# Altium project PCB_15122020_01BC.PrjPcb (part 5 of 9)

## Sheet RaspberyConnector.SchDoc
size A3
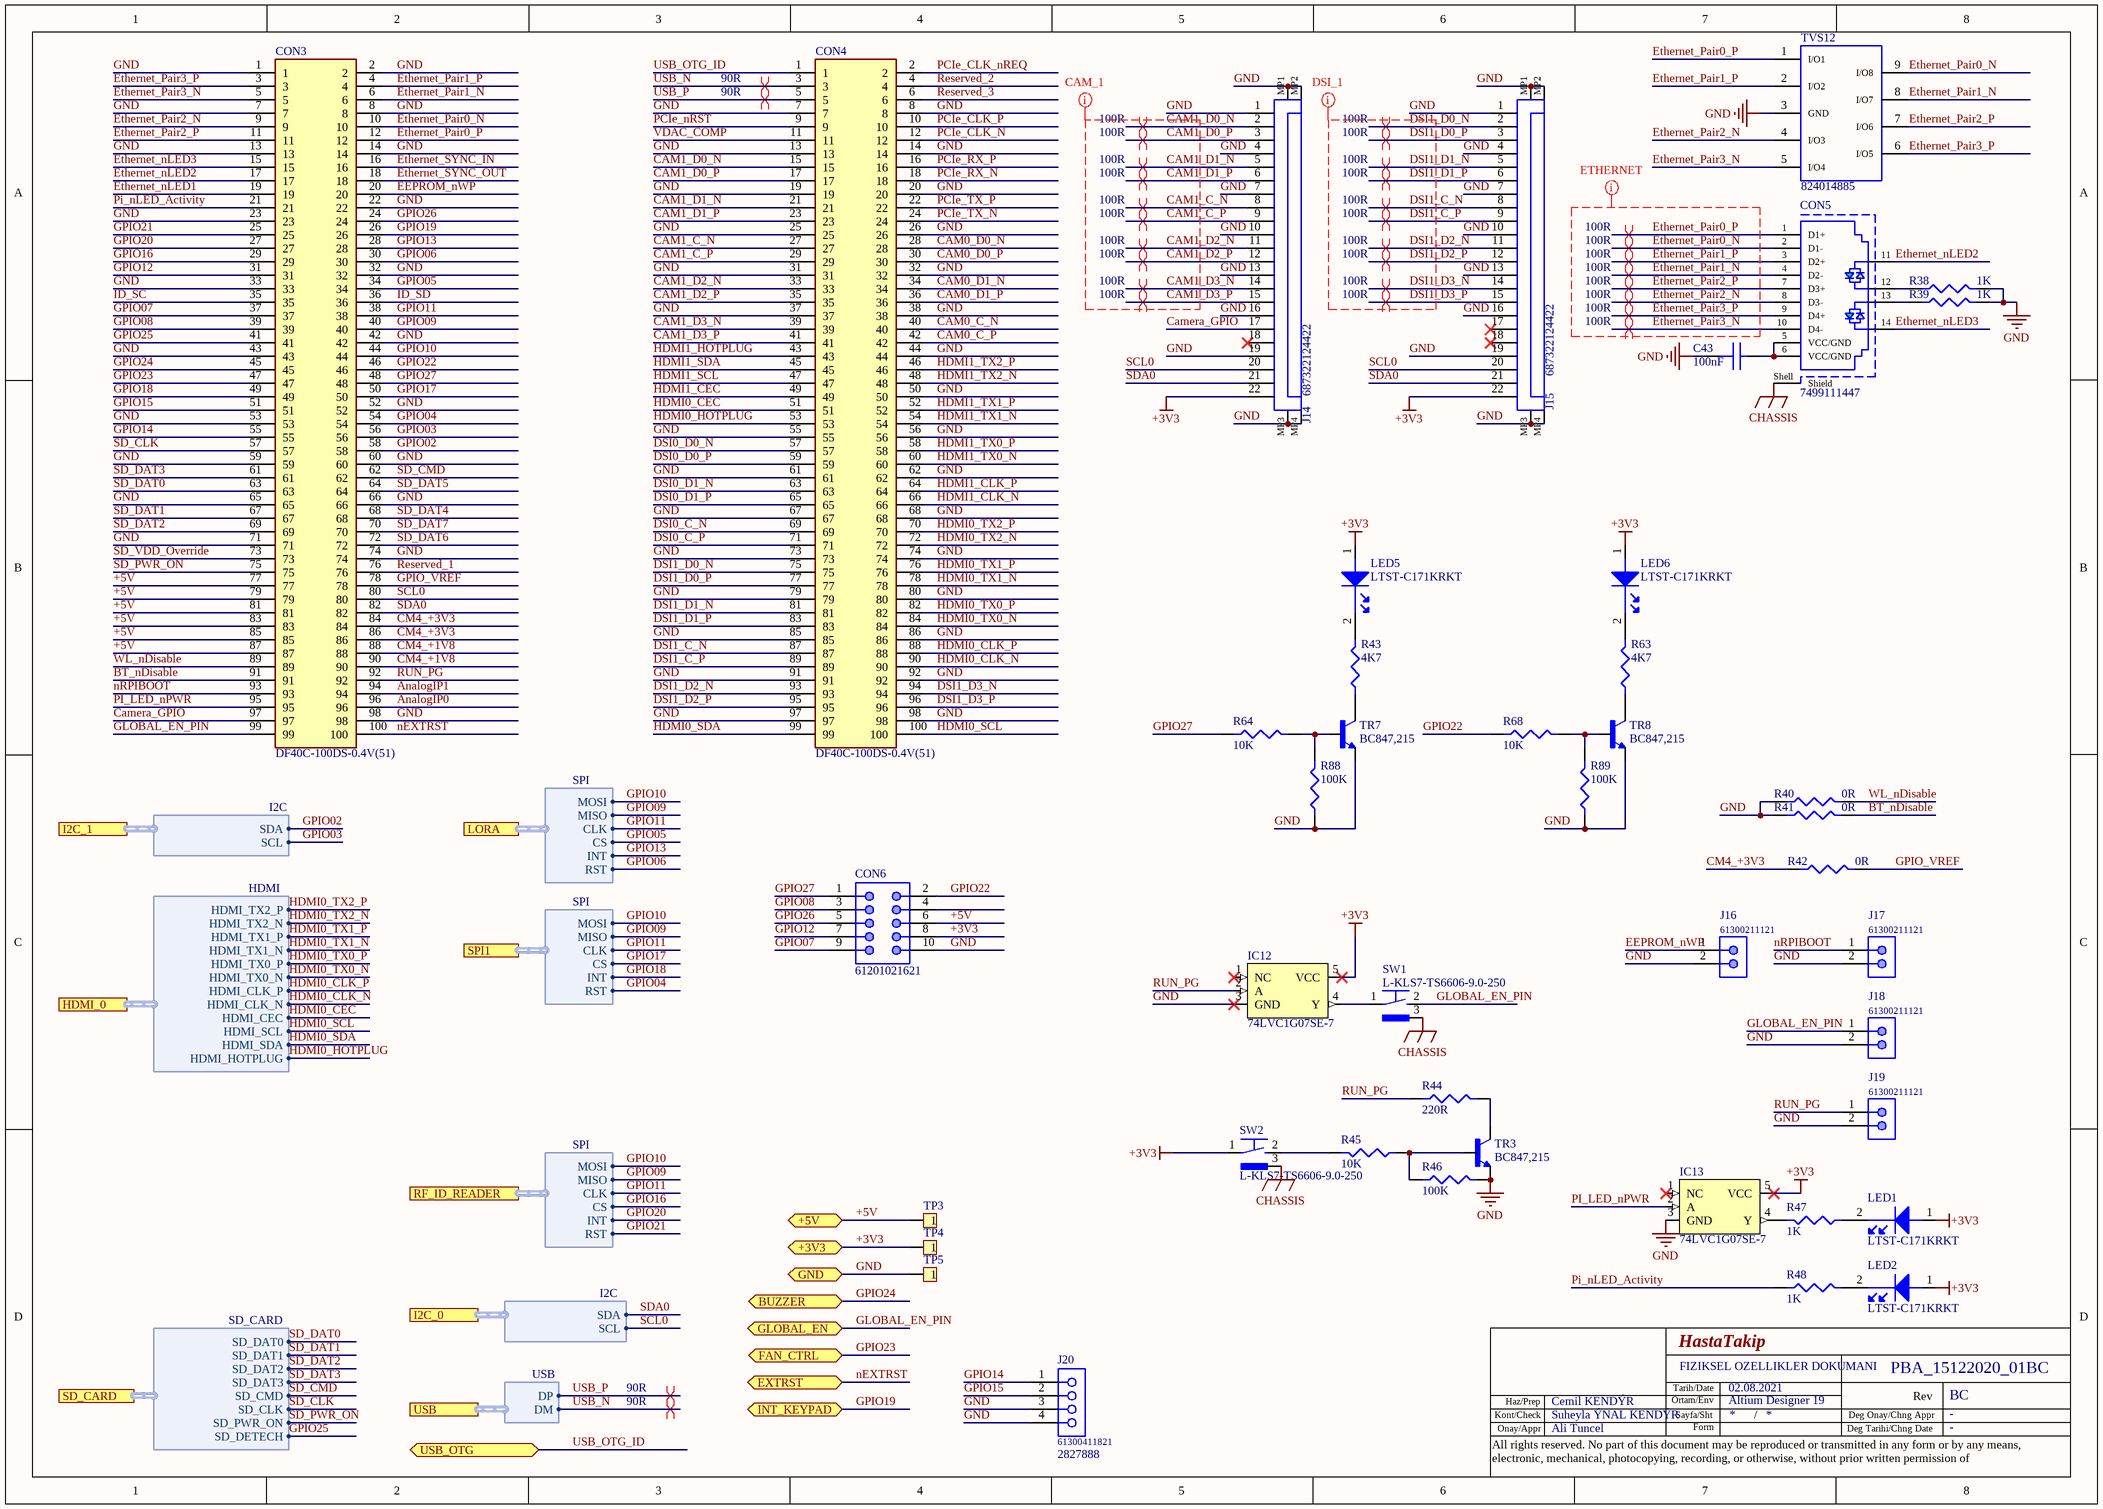
[diagram p4: RaspberyConnector.SchDoc]

### Parts
C43  100nF  [C0603]
CON3  DF40C-100DS-0.4V(51)  [HRS_DF40C-100DS-0.4V(51)]
CON4  DF40C-100DS-0.4V(51)  [HRS_DF40C-100DS-0.4V(51)]
CON5  7499111447  [7499111447]
CON6  61201021621  [61201021621]
IC12  74LVC1G07SE-7  [SOT353]
IC13  74LVC1G07SE-7  [SOT353]
J14  687322124422  [687322124422]
J15  687322124422  [687322124422]
J16  61300211121  [61300211121]
J17  61300211121  [61300211121]
J18  61300211121  [61300211121]
J19  61300211121  [61300211121]
J20  61300411821  Supplier Part Number 1: 2827888  [61300411821]
LED1  LTST-C171KRKT  [0805_RED]
LED2  LTST-C171KRKT  [0805_RED]
LED5  LTST-C171KRKT  [0805_RED]
LED6  LTST-C171KRKT  [0805_RED]
R38  1K  [R0603]
R39  1K  [R0603]
R40  0R  [R0603]
R41  0R  [R0603]
R42  0R  [R0603]
R43  4K7  [R0603]
R44  220R  [R0603]
R45  10K  [R0603]
R46  100K  [R0603]
R47  1K  [R0603]
R48  1K  [R0603]
R63  4K7  [R0603]
R64  10K  [R0603]
R68  10K  [R0603]
R88  100K  [R0603]
R89  100K  [R0603]
SW1  L-KLS7-TS6606-9.0-250  [Right angle 9mm]
SW2  L-KLS7-TS6606-9.0-250  [Right angle 9mm]
TP3  TestPoint1  [SMD_2mmPoint]  (value not drawn)
TP4  TestPoint1  [SMD_2mmPoint]  (value not drawn)
TP5  TestPoint1  [SMD_2mmPoint]  (value not drawn)
TR3  BC847,215  [SOT23]
TR7  BC847,215  [SOT23]
TR8  BC847,215  [SOT23]
TVS12  824014885  [WE-TVS_DFN3810-9L]

### Ports
+3V3 (bidir), +5V (bidir), BUZZER (bidir), EXTRST (bidir), FAN_CTRL (bidir), GLOBAL_EN (bidir), GND (bidir), HDMI_0 (harness HDMI), I2C_0 (harness I2C), I2C_1 (harness I2C), INT_KEYPAD (bidir), LORA (harness SPI), RF_ID_READER (harness SPI), SD_CARD (harness SD_CARD), SPI1 (harness SPI), USB (harness USB), USB_OTG (bidir)

### Harnesses
USB: DP, DM
I2C: SCL, SDA
HDMI: HDMI_CLK_N, HDMI_TX2_P, HDMI_CLK_P, HDMI_TX0_N, HDMI_TX2_N, HDMI_TX1_P, HDMI_TX1_N, HDMI_TX0_P, HDMI_CEC, HDMI_SCL, HDMI_SDA, HDMI_HOTPLUG
SD_CARD: SD_DAT0, SD_DAT1, SD_DAT2, SD_DAT3, SD_CMD, SD_CLK, SD_PWR_ON, SD_DETECH
SPI: MOSI, MISO, CLK, CS, INT, RST

### Nets
+3V3: CON6.8 IC12.5(VCC) IC13.5(VCC) J14.22 J15.22 LED1.1 LED2.1 LED5.1 LED6.1 SW2.1 TP4.1 ; port +3V3
+5V: CON3.77 CON3.79 CON3.81 CON3.83 CON3.85 CON3.87 CON6.6 TP3.1 ; port +5V
CHASSIS: CON5.Shell(Shield) SW1.3 SW2.3
GND: C43.2 CON3.1 CON3.2 CON3.7 CON3.8 CON3.13 CON3.14 CON3.22 CON3.23 CON3.32 CON3.33 CON3.42 CON3.43 CON3.52 CON3.53 CON3.59 CON3.60 CON3.65 CON3.66 CON3.71 CON3.74 CON3.98 CON4.7 CON4.8 CON4.13 CON4.14 CON4.19 CON4.20 CON4.25 CON4.26 CON4.31 CON4.32 CON4.37 CON4.38 CON4.44 CON4.50 CON4.55 CON4.56 CON4.61 CON4.62 CON4.67 CON4.68 CON4.73 CON4.74 CON4.79 CON4.80 CON4.85 CON4.86 CON4.91 CON4.92 CON4.97 CON4.98 CON6.10 IC12.3(GND) IC13.3(GND) J14.1 J14.4 J14.7 J14.10 J14.13 J14.16 J14.19 J14.MP1 J14.MP2 J14.MP3 J14.MP4 J15.1 J15.4 J15.7 J15.10 J15.13 J15.16 J15.19 J15.MP1 J15.MP2 J15.MP3 J15.MP4 J16.2 J17.2 J18.2 J19.2 J20.3 J20.4 R38.2 R39.2 R40.1 R41.1 R46.2 R88.1 R89.1 TP5.1 TR3.2(E) TR7.2(E) TR8.2(E) TVS12.3(GND) ; port GND
AnalogIP0: CON3.96
AnalogIP1: CON3.94
BT_nDisable: CON3.91 R41.2
CAM0_C_N: CON4.40
CAM0_C_P: CON4.42
CAM0_D0_N: CON4.28
CAM0_D0_P: CON4.30
CAM0_D1_N: CON4.34
CAM0_D1_P: CON4.36
CAM1_C_N: CON4.27 J14.8
CAM1_C_P: CON4.29 J14.9
CAM1_D0_N: CON4.15 J14.2
CAM1_D0_P: CON4.17 J14.3
CAM1_D1_N: CON4.21 J14.5
CAM1_D1_P: CON4.23 J14.6
CAM1_D2_N: CON4.33 J14.11
CAM1_D2_P: CON4.35 J14.12
CAM1_D3_N: CON4.39 J14.14
CAM1_D3_P: CON4.41 J14.15
Camera_GPIO: CON3.97 J14.17
CM4_+1V8: CON3.88 CON3.90
CM4_+3V3: CON3.84 CON3.86 R42.1
DSI0_C_N: CON4.69
DSI0_C_P: CON4.71
DSI0_D0_N: CON4.57
DSI0_D0_P: CON4.59
DSI0_D1_N: CON4.63
DSI0_D1_P: CON4.65
DSI1_C_N: CON4.87 J15.8
DSI1_C_P: CON4.89 J15.9
DSI1_D0_N: CON4.75 J15.2
DSI1_D0_P: CON4.77 J15.3
DSI1_D1_N: CON4.81 J15.5
DSI1_D1_P: CON4.83 J15.6
DSI1_D2_N: CON4.93 J15.11
DSI1_D2_P: CON4.95 J15.12
DSI1_D3_N: CON4.94 J15.14
DSI1_D3_P: CON4.96 J15.15
EEPROM_nWP: CON3.20 J16.1
Ethernet_nLED1: CON3.19
Ethernet_nLED2: CON3.17 CON5.11
Ethernet_nLED3: CON3.15 CON5.14
Ethernet_Pair0_N: CON3.10 CON5.2(D1-) TVS12.9(I/O8)
Ethernet_Pair0_P: CON3.12 CON5.1(D1+) TVS12.1(I/O1)
Ethernet_Pair1_N: CON3.6 CON5.4(D2-) TVS12.8(I/O7)
Ethernet_Pair1_P: CON3.4 CON5.3(D2+) TVS12.2(I/O2)
Ethernet_Pair2_N: CON3.9 CON5.8(D3-) TVS12.4(I/O3)
Ethernet_Pair2_P: CON3.11 CON5.7(D3+) TVS12.7(I/O6)
Ethernet_Pair3_N: CON3.5 CON5.10(D4-) TVS12.5(I/O4)
Ethernet_Pair3_P: CON3.3 CON5.9(D4+) TVS12.6(I/O5)
Ethernet_SYNC_IN: CON3.16
Ethernet_SYNC_OUT: CON3.18
GLOBAL_EN_PIN: CON3.99 J18.1 SW1.2 ; port GLOBAL_EN
GPIO02: CON3.58 ; port I2C_1.SDA
GPIO03: CON3.56 ; port I2C_1.SCL
GPIO04: CON3.54 ; port SPI1.RST
GPIO05: CON3.34 ; port LORA.CS
GPIO06: CON3.30 ; port LORA.RST
GPIO07: CON3.37 CON6.9
GPIO08: CON3.39 CON6.3
GPIO09: CON3.40 ; port RF_ID_READER.MISO, port SPI1.MISO, port LORA.MISO
GPIO10: CON3.44 ; port RF_ID_READER.MOSI, port SPI1.MOSI, port LORA.MOSI
GPIO11: CON3.38 ; port RF_ID_READER.CLK, port SPI1.CLK, port LORA.CLK
GPIO12: CON3.31 CON6.7
GPIO13: CON3.28 ; port LORA.INT
GPIO14: CON3.55 J20.1
GPIO15: CON3.51 J20.2
GPIO16: CON3.29 ; port RF_ID_READER.CS
GPIO17: CON3.50 ; port SPI1.CS
GPIO18: CON3.49 ; port SPI1.INT
GPIO19: CON3.26 ; port INT_KEYPAD
GPIO20: CON3.27 ; port RF_ID_READER.INT
GPIO21: CON3.25 ; port RF_ID_READER.RST
GPIO22: CON3.46 CON6.2 R68.1
GPIO23: CON3.47 ; port FAN_CTRL
GPIO24: CON3.45 ; port BUZZER  [project net BUZZER]
GPIO25: CON3.41 ; port SD_CARD.SD_DETECH
GPIO26: CON3.24 CON6.5
GPIO27: CON3.48 CON6.1 R64.1
GPIO_VREF: CON3.78 R42.2
HDMI0_CEC: CON4.51 ; port HDMI_0.HDMI_CEC
HDMI0_CLK_N: CON4.90 ; port HDMI_0.HDMI_CLK_N
HDMI0_CLK_P: CON4.88 ; port HDMI_0.HDMI_CLK_P
HDMI0_HOTPLUG: CON4.53 ; port HDMI_0.HDMI_HOTPLUG
HDMI0_SCL: CON4.100 ; port HDMI_0.HDMI_SCL
HDMI0_SDA: CON4.99 ; port HDMI_0.HDMI_SDA
HDMI0_TX0_N: CON4.84 ; port HDMI_0.HDMI_TX0_N
HDMI0_TX0_P: CON4.82 ; port HDMI_0.HDMI_TX0_P
HDMI0_TX1_N: CON4.78 ; port HDMI_0.HDMI_TX1_N
HDMI0_TX1_P: CON4.76 ; port HDMI_0.HDMI_TX1_P
HDMI0_TX2_N: CON4.72 ; port HDMI_0.HDMI_TX2_N
HDMI0_TX2_P: CON4.70 ; port HDMI_0.HDMI_TX2_P
HDMI1_CEC: CON4.49
HDMI1_CLK_N: CON4.66
HDMI1_CLK_P: CON4.64
HDMI1_HOTPLUG: CON4.43
HDMI1_SCL: CON4.47
HDMI1_SDA: CON4.45
HDMI1_TX0_N: CON4.60
HDMI1_TX0_P: CON4.58
HDMI1_TX1_N: CON4.54
HDMI1_TX1_P: CON4.52
HDMI1_TX2_N: CON4.48
HDMI1_TX2_P: CON4.46
ID_SC: CON3.35
ID_SD: CON3.36
nEXTRST: CON3.100 ; port EXTRST
nRPIBOOT: CON3.93 J17.1
PCIe_CLK_N: CON4.12
PCIe_CLK_nREQ: CON4.2
PCIe_CLK_P: CON4.10
PCIe_nRST: CON4.9
PCIe_RX_N: CON4.18
PCIe_RX_P: CON4.16
PCIe_TX_N: CON4.24
PCIe_TX_P: CON4.22
PI_LED_nPWR: CON3.95 IC13.2(A)
Pi_nLED_Activity: CON3.21 R48.1
Reserved_1: CON3.76
Reserved_2: CON4.4
Reserved_3: CON4.6
RUN_PG: CON3.92 IC12.2(A) J19.1 R44.1
SCL0: CON3.80 J14.20 J15.20 ; port I2C_0.SCL
SD_CLK: CON3.57 ; port SD_CARD.SD_CLK
SD_CMD: CON3.62 ; port SD_CARD.SD_CMD
SD_DAT0: CON3.63 ; port SD_CARD.SD_DAT0
SD_DAT1: CON3.67 ; port SD_CARD.SD_DAT1
SD_DAT2: CON3.69 ; port SD_CARD.SD_DAT2
SD_DAT3: CON3.61 ; port SD_CARD.SD_DAT3
SD_DAT4: CON3.68
SD_DAT5: CON3.64
SD_DAT6: CON3.72
SD_DAT7: CON3.70
SD_PWR_ON: CON3.75 ; port SD_CARD.SD_PWR_ON
SD_VDD_Override: CON3.73
SDA0: CON3.82 J14.21 J15.21 ; port I2C_0.SDA
USB_N: CON4.3 ; port USB.DM
USB_OTG_ID: CON4.1 ; port USB_OTG
USB_P: CON4.5 ; port USB.DP
VDAC_COMP: CON4.11
WL_nDisable: CON3.89 R40.2
NetC43_1: C43.1 CON5.5(VCC/GND) CON5.6(VCC/GND)
NetCON5_12: CON5.12 R38.1
NetCON5_13: CON5.13 R39.1
NetIC12_4: IC12.4(Y) SW1.1
NetIC13_4: IC13.4(Y) R47.2
NetLED1_2: LED1.2 R47.1
NetLED2_2: LED2.2 R48.2
NetLED5_2: LED5.2 R43.2
NetLED6_2: LED6.2 R63.2
NetR43_1: R43.1 TR7.3(C)
NetR44_2: R44.2 TR3.3(C)
NetR45_1: R45.1 R46.1 TR3.1(B)
NetR45_2: R45.2 SW2.2
NetR63_1: R63.1 TR8.3(C)
NetR64_2: R64.2 R88.2 TR7.1(B)
NetR68_2: R68.2 R89.2 TR8.1(B)

Not connected (* = marked no-connect by the designer): CON6 4; IC12 1(NC)*; IC13 1(NC)*; J14 18*; J15 17* 18*

### Layout directives
differential pair; differential pair class 90R: USB_N, USB_P
differential pair; differential pair class 100R: CAM1_C_N, CAM1_C_P, CAM1_D0_N, CAM1_D0_P, CAM1_D1_N, CAM1_D1_P, CAM1_D2_N, CAM1_D2_P, CAM1_D3_N, CAM1_D3_P, DSI1_C_N, DSI1_C_P, DSI1_D0_N, DSI1_D0_P, DSI1_D1_N, DSI1_D1_P, DSI1_D2_N, DSI1_D2_P, DSI1_D3_N, DSI1_D3_P, Ethernet_Pair0_N, Ethernet_Pair0_P, Ethernet_Pair1_N, Ethernet_Pair1_P, Ethernet_Pair2_N, Ethernet_Pair2_P, Ethernet_Pair3_N, Ethernet_Pair3_P
net class CAM_1: CAM1_C_N, CAM1_C_P, CAM1_D0_N, CAM1_D0_P, CAM1_D1_N, CAM1_D1_P, CAM1_D2_N, CAM1_D2_P, CAM1_D3_N, CAM1_D3_P
net class DSI_1: DSI1_C_N, DSI1_C_P, DSI1_D0_N, DSI1_D0_P, DSI1_D1_N, DSI1_D1_P, DSI1_D2_N, DSI1_D2_P, DSI1_D3_N, DSI1_D3_P
net class ETHERNET: Ethernet_Pair0_N, Ethernet_Pair0_P, Ethernet_Pair1_N, Ethernet_Pair1_P, Ethernet_Pair2_N, Ethernet_Pair2_P, Ethernet_Pair3_N, Ethernet_Pair3_P

### Notes on the sheet
- Tarih/Date
- Kont/Check
- Onay/Appr
- Haz/Prep
- Ortam/Env
- Sayfa/Sht
- Form
- /
- Deg Tarihi/Chng Date
- Deg Onay/Chng Appr
- Rev
- All rights reserved. No part of this document may be reproduced or transmitted in any form or by any means, electronic, mechanical, photocopying, recording, or otherwise, without prior written permission of

### Library data of the parts
C43 = CC0603KRX7R8BB104: 100nF, 25V, X7R, 10%, 0603; Manufacturer: Yageo; Supplier 1: Digi-Key; Supplier Part Number 1: 311-1341-1-ND; Manufacturer Part Number: CC0603KRX7R8BB104; Stock 1: 10150433; Pricing 1: 1 = 0,10000, 10 = 0,04500, 50 = 0,02480, 100 = 0,02020, 500 = 0,01444, 1000 = 0,01134 (USD); RoHS: Yes; Mount: Surface Mount; Case/Package: 0603; Number of Pins: 2; Case Code (Imperial): 0603; Case Code (Metric): 1608; Min Operating Temperature: -55°C; Max Operating Temperature: 125°C; Capacitance: 100nF; Tolerance: 10%; Voltage Rating: 25V; Packaging: Tape and Reel; Package Quantity: 1; Voltage Rating (DC): 25V; Dielectric: X7R; Termination: SMD/SMT; Resistor Type: Ceramic; Voltage: 25V; Length: 1.6mm; Width: 0.8mm; Height: 0.8mm; Thickness: 0.035inch; Depth: 0.8mm; Radiation Hardening: No; REACH SVHC: Unknown; Lead Free: Lead Free; Halogen Free: Halogen Free; ComponentLink1URL: https://datasheet.ciiva.com/11786/0900766b80c10176-11786120.pdf?src-supplier=RSComponents; ComponentLink1Description: https://datasheet.ciiva.com/11786/0900766b80c10176-11786120.pdf?src-supplier=RSComponents; ComponentLink2URL: https://datasheet.ciiva.com/144/mlccorderingcode-144075.pdf?src-supplier=Digi-Key; ComponentLink2Description: https://datasheet.ciiva.com/144/mlccorderingcode-144075.pdf?src-supplier=Digi-Key; ComponentLink3URL: https://datasheet.ciiva.com/17434/upy-gphc-x7r-6-3v-to-50v-8-17434263.pdf?src-supplier=Avnet+Europe; ComponentLink3Description: https://datasheet.ciiva.com/17434/upy-gphc-x7r-6-3v-to-50v-8-17434263.pdf?src-supplier=Avnet+Europe; ComponentLink4URL: https://datasheet.ciiva.com/26829/getdatasheetpartid-403577-26829431.pdf?src-supplier=Verical; ComponentLink4Description: https://datasheet.ciiva.com/26829/getdatasheetpartid-403577-26829431.pdf?src-supplier=Verical; ComponentLink5URL: https://datasheet.ciiva.com/11587/upy-gphc-x7r-6-3v-to-50v-8-11587208.pdf?src-supplier=Avnet; ComponentLink5Description: https://datasheet.ciiva.com/11587/upy-gphc-x7r-6-3v-to-50v-8-11587208.pdf?src-supplier=Avnet; ComponentLink6URL: https://datasheet.ciiva.com/13389/upy-gphc-x7r-6-3v-to-50v-8-13389352.pdf?src-supplier=Mouser; ComponentLink6Description: https://datasheet.ciiva.com/13389/upy-gphc-x7r-6-3v-to-50v-8-13389352.pdf?src-supplier=Mouser; ComponentLink7URL: https://datasheet.ciiva.com/28450/1489800-28450584.pdf?src-supplier=Element14; ComponentLink7Description: https://datasheet.ciiva.com/28450/1489800-28450584.pdf?src-supplier=Element14; ComponentLink8URL: https://datasheet.ciiva.com/144/mlccorderingcode-144073.pdf?src-supplier=Digi-Key; ComponentLink8Description: https://datasheet.ciiva.com/144/mlccorderingcode-144073.pdf?src-supplier=Digi-Key; ComponentLink9URL: https://datasheet.ciiva.com/144/mlccorderingcode-144074.pdf?src-supplier=Digi-Key; ComponentLink9Description: https://datasheet.ciiva.com/144/mlccorderingcode-144074.pdf?src-supplier=Digi-Key; ComponentLink10URL: https://datasheet.ciiva.com/7978/1489800-7978155.pdf?src-supplier=Element14; ComponentLink10Description: https://datasheet.ciiva.com/7978/1489800-7978155.pdf?src-supplier=Element14; Category: Capasitor
CON3 CON4 = DF40C-100DS-0.4V(51): Manufacturer: Hirose; Connector Type: Receptacle; Number of Positions: 100; Max Voltage Rating (AC): 30V; Contact Resistance: 90mR; Max Current Rating: 300mA; Pitch: 0.4mm; Mated Stacking Heights: 1.5mm; Supplier 1: Digi-Key; Manufacturer Part Number: DF40C-100DS-0.4V(51); Stock 1: 4110; Pricing 1: 1 = 1,73000, 10 = 1,56800, 25 = 1,47200, 50 = 1,40800, 100 = 1,34400, 250 = 1,21600, 500 = 1,12000, 1000 = 0,96000, 2500 = 0,89600 (USD); RoHS: Yes; Mount: Surface Mount; Housing Material: Polymer; Housing Color: Black; Contact Material: Bronze; Contact Plating: Gold; Min Operating Temperature: -35°C; Max Operating Temperature: 85°C; Orientation: Straight; Termination: SMD/SMT; Number of Contacts: 100; Gender: Receptacle; Number of Rows: 2; Packaging: Tape and Reel; Package Quantity: 1; Voltage Rating: 30V; Current Rating: 300mA; Length: 22.6mm; Depth: 3.38mm; Radiation Hardening: No; Lead Free: Lead Free; REACH SVHC: Unknown; ComponentLink1URL: https://datasheet.ciiva.com/26948/getdatasheetpartid-441624-26948933.pdf?src-supplier=Verical; ComponentLink1Description: https://datasheet.ciiva.com/26948/getdatasheetpartid-441624-26948933.pdf?src-supplier=Verical; ComponentLink2URL: https://datasheet.ciiva.com/46408/1824826-46408894.pdf?src-supplier=Element14; ComponentLink2Description: https://datasheet.ciiva.com/46408/1824826-46408894.pdf?src-supplier=Element14; Supplier Part Number 1: H11615CT-ND; Category: Connectors, Interconnects Rectangular Connectors - Arrays, Edge Type, Mezzanine (Board to Board)
CON5 = 7499111447: WURTH ELEKTRONIK - 7499111447 - MODULAR JACK, RJ45, 1000 BASE, 1PORT; Manufacturer: Wurth Electronics; Gender: Female; Shielding: Shielded; Number of Positions: 8; Number of Ports: 1; Direction: Up; Connector Type: RJ45,Socket; Pitch: 2.54mm; Supplier 1: Digi-Key; Supplier Part Number 1: 732-4058-ND; Manufacturer Part Number: 7499111447; Stock 1: 1486; Pricing 1: 1 = 11,37000, 10 = 10,23000, 29 = 9,30000, 116 = 8,10000 (USD); RoHS: Yes; Mount: Through Hole; Case/Package: Metal; Contact Plating: Gold; Contact Material: Ferrite,Gold; Color: Green,Yellow,Silver; Housing Material: Thermoplastic; Min Operating Temperature: -40°C; Max Operating Temperature: 85°C; Packaging: Rail/Tube; Package Quantity: 29; Number of Rows: 1; Termination: Through Hole; Number of Positions Loaded: 8; Number of Contacts: 8; Orientation: Right Angle; Number of Cores per Jack: 8; Length: 16mm; Depth: 21.3mm; Lead Free: Lead Free; REACH SVHC: Unknown; Flammability Rating: UL94 V-0; ComponentLink1URL: https://datasheet.ciiva.com/22644/1685998-22644754.pdf?src-supplier=Element14; ComponentLink1Description: https://datasheet.ciiva.com/22644/1685998-22644754.pdf?src-supplier=Element14; ComponentLink2URL: https://datasheet.ciiva.com/6931/7499111447-6931883.pdf?src-supplier=Digi-Key; ComponentLink2Description: https://datasheet.ciiva.com/6931/7499111447-6931883.pdf?src-supplier=Digi-Key; ComponentLink3URL: https://datasheet.ciiva.com/24091/7499111447-254315-24091264.pdf?src-supplier=Mouser; ComponentLink3Description: https://datasheet.ciiva.com/24091/7499111447-254315-24091264.pdf?src-supplier=Mouser; ComponentLink4URL: https://datasheet.ciiva.com/23754/1685998-23754767.pdf?src-supplier=Newark; ComponentLink4Description: https://datasheet.ciiva.com/23754/1685998-23754767.pdf?src-supplier=Newark; ComponentLink5URL: https://datasheet.ciiva.com/48689/001088886-da-01-en-integrated-rj45-we-rj45lan-7499111447-48689525.pdf?src-supplier=Conrad; ComponentLink5Description: https://datasheet.ciiva.com/48689/001088886-da-01-en-integrated-rj45-we-rj45lan-7499111447-48689525.pdf?src-supplier=Conrad; Category: Connectors, Interconnects Modular Connectors - Jacks With Magnetics
CON6 = 61201021621: WURTH ELEKTRONIK - 61201021621 - Pin Header, Wire-to-Board, 2.54 mm, 2 Rows, 10 Contacts, Through Hole Straight, WR-BHD Series; Manufacturer: Wurth Electronics; Current Rating: 3A; Voltage Rating: 250V; Number of Positions: 10; Insulation Resistance: 1GR; Gender: Male; Connector Type: Male Pin; Pitch: 2.54mm; Row Spacing: 0.1inch; Supplier 1: Digi-Key; Supplier Part Number 1: 732-2094-ND; Manufacturer Part Number: 61201021621; Stock 1: 15759; Pricing 1: 1 = 0,45000, 10 = 0,43700, 50 = 0,40300, 100 = 0,36100, 260 = 0,31900, 520 = 0,31100 (USD); RoHS: Yes; Mount: Through Hole; Color: Black; Contact Material: Copper Alloy,Copper; Contact Plating: Gold; Housing Material: PBT; Min Operating Temperature: -40°C; Max Operating Temperature: 125°C; Package Quantity: 260; Number of Rows: 2; Packaging: Tray; Contact Gender: Male; Termination: Solder; Number of Contacts: 10; Orientation: Straight; Length: 9.1mm; Width: 20.36mm; Height: 8.85mm; REACH SVHC: Unknown; Lead Free: Lead Free; Flammability Rating: UL94 V-0; ComponentLink1URL: https://datasheet.ciiva.com/731/6120xx21621-731344.pdf?src-supplier=Digi-Key; ComponentLink1Description: https://datasheet.ciiva.com/731/6120xx21621-731344.pdf?src-supplier=Digi-Key; ComponentLink2URL: https://datasheet.ciiva.com/15395/6120xx21621-265834-15395106.pdf?src-supplier=Mouser; ComponentLink2Description: https://datasheet.ciiva.com/15395/6120xx21621-265834-15395106.pdf?src-supplier=Mouser; ComponentLink3URL: https://datasheet.ciiva.com/7648/76595-7648121.pdf?src-supplier=Element14; ComponentLink3Description: https://datasheet.ciiva.com/7648/76595-7648121.pdf?src-supplier=Element14; Category: Connectors, Interconnects Rectangular Connectors - Headers, Male Pins
IC12 IC13 = 74LVC1G07SE-7: Buffer/Driver 1-CH Non-Inverting Open Drain CMOS 5-Pin SOT-353 T/R; Manufacturer: Diodes; Number of Gates: 1; Max Supply Voltage: 5.5V; Min Supply Voltage: 1.65V; Propagation Delay: 8.5ns; Logic Function: Buffer,Inverting; Polarity: Inverting,Non-Inverting; Low Level Output Current: 32mA; Operating Supply Current: 10uA; Quiescent Current: 200uA; Supplier 1: Digi-Key; Supplier Part Number 1: 74LVC1G07SE-7DICT-ND; Manufacturer Part Number: 74LVC1G07SE-7; Stock 1: 16164; Pricing 1: 1 = 0,26000, 10 = 0,21500, 25 = 0,18000, 100 = 0,11400, 250 = 0,08800, 500 = 0,07500, 1000 = 0,05100 (USD); RoHS: Yes; Mount: Surface Mount; Case/Package: SOT-353; Number of Pins: 5; Min Operating Temperature: -40°C; Max Operating Temperature: 85°C; Number of Inputs: 1; Packaging: Tape and Reel; Package Quantity: 3000; Number of Elements: 1; Number of Channels: 1; Number of Outputs: 1; Number of Input Lines: 1; Number of Output Lines: 1; Number of Bits per Element: 1; Turn-On Delay Time: 8.5ns; Length: 2.2mm; Width: 1.35mm; Height: 1mm; Radiation Hardening: No; REACH SVHC: No SVHC; Lead Free: Lead Free; ComponentLink1URL: https://datasheet.ciiva.com/8260/74lvc1g07-8260976.pdf?src-supplier=Avnet; ComponentLink1Description: https://datasheet.ciiva.com/8260/74lvc1g07-8260976.pdf?src-supplier=Avnet; ComponentLink2URL: https://datasheet.ciiva.com/26856/getdatasheetpartid-302086-26856250.pdf?src-supplier=Verical; ComponentLink2Description: https://datasheet.ciiva.com/26856/getdatasheetpartid-302086-26856250.pdf?src-supplier=Verical; ComponentLink3URL: https://datasheet.ciiva.com/1832/74lvc1g07-1832566.pdf?src-supplier=Digi-Key; ComponentLink3Description: https://datasheet.ciiva.com/1832/74lvc1g07-1832566.pdf?src-supplier=Digi-Key; ComponentLink4URL: https://datasheet.ciiva.com/1832/74lvc1g07-1832567.pdf?src-supplier=Digi-Key; ComponentLink4Description: https://datasheet.ciiva.com/1832/74lvc1g07-1832567.pdf?src-supplier=Digi-Key; ComponentLink5URL: https://datasheet.ciiva.com/1832/74lvc1g07-1832568.pdf?src-supplier=Digi-Key; ComponentLink5Description: https://datasheet.ciiva.com/1832/74lvc1g07-1832568.pdf?src-supplier=Digi-Key; ComponentLink6URL: https://datasheet.ciiva.com/1506/74lvc1g07-1506202.pdf?src-supplier=Element14; ComponentLink6Description: https://datasheet.ciiva.com/1506/74lvc1g07-1506202.pdf?src-supplier=Element14; ComponentLink7URL: https://datasheet.ciiva.com/17291/74lvc1g07-17291948.pdf?src-supplier=Avnet+Europe; ComponentLink7Description: https://datasheet.ciiva.com/17291/74lvc1g07-17291948.pdf?src-supplier=Avnet+Europe; ComponentLink8URL: https://datasheet.ciiva.com/8305/74lvc1g07-8305775.pdf?src-supplier=Avnet; ComponentLink8Description: https://datasheet.ciiva.com/8305/74lvc1g07-8305775.pdf?src-supplier=Avnet; Category: Integrated Circuits (ICs) Logic - Buffers, Drivers, Receivers, Transceivers
J14 J15 = 687322124422: WR-FPC SMT ZIF Vertical, pitch 0.5mm, 22p; Manufacturer: Wurth Elektronik; Contact Resistance: 20mOhm; Pin Number: 22; Working Voltage: 50VAC; Rated Current: 0.5A; ComponentLink1Description: Manufacturer; ComponentLink1URL: http://www.we-online.de; ComponentLink2Description: Datasheet; ComponentLink2URL: https://katalog.we-online.com/em/datasheet/687322124422.pdf; Packaging: Tape and Reel; Pitch: 0.5mm; Published Date: November 2019; Mounting Technology: SMT; Operating Temperature: -25 to +85degC; Length: 17.4mm; Part Number: 687322124422; Type: Vertical; Publisher: Wurth Elektronik; Category: WR-FPC SMT ZIF Vertical, pitch 0.5mm, 22p
J16-J19 = 61300211121: WR-PHD Pin Header, THT, pitch 2.54mm, Single Row, Vertical, 2pin; Manufacturer: Wurth Electronics; Pin Number: 2; Gender: Male; Rated Current: 3A; Working Voltage: 250VAC; Withstanding Voltage: 500VAC; Contact Resistance: 20mOhm; Voltage Rating: 250V; Connector Type: Male Pin; ComponentLink1Description: Manufacturer; ComponentLink1URL: http://www.we-online.de; ComponentLink2Description: Datasheet; ComponentLink2URL: https://katalog.we-online.de/em/datasheet/6130xx11121.pdf; Part Number: 61300211121; Published Date: June 2019; Publisher: Wurth Elektronik; Pitch: 2.54mm; Operating Temperature: -40 to +105degC; Mounting Technology: THT; Packaging: Bag; Row Number: Single; Orientation: Vertical; Supplier 1: Digi-Key; Manufacturer Part Number: 61300211121; Stock 1: 150487; Pricing 1: 1 = 0,13000, 10 = 0,10600, 25 = 0,08800, 50 = 0,07400, 100 = 0,06700, 1000 = 0,06100 (USD); RoHS: Yes; Mount: Through Hole; Contact Plating: Gold; Housing Material: PBT; Contact Material: Copper Alloy,Copper; Color: Black; Min Operating Temperature: -40°C; Max Operating Temperature: 125°C; Number of Rows: 1; Contact Gender: Male; Current Rating: 3A; Number of Positions: 2; Termination: Through Hole; Number of Contacts: 2; Contact Mating Length: 0.236inch; REACH SVHC: Unknown; Lead Free: Lead Free; ComponentLink3URL: https://datasheet.ciiva.com/13619/6130xx11121-48870-13619345.pdf?src-supplier=Mouser; ComponentLink3Description: https://datasheet.ciiva.com/13619/6130xx11121-48870-13619345.pdf?src-supplier=Mouser; Category: Connectors, Interconnects Rectangular Connectors; Supplier Part Number 1: 732-5315-ND
J20 = 61300411821: WR-PHD Socket Header, THT, pitch 2.54mm, Single Row, Vertical, 4pin; Manufacturer: Wurth Electronics; Pin Number: 4; Gender: Female; Rated Current: 3A; Working Voltage: 250VAC; Withstanding Voltage: 500VAC; Contact Resistance: 20mOhm; ComponentLink1Description: Manufacturer; ComponentLink1URL: http://www.we-online.de; ComponentLink2Description: Datasheet; ComponentLink2URL: https://katalog.we-online.de/em/datasheet/6130xx11821.pdf; Part Number: 61300411821; Published Date: June 2019; Publisher: Wurth Elektronik; Pitch: 2.54mm; Operating Temperature: -40 to +125degC; Mounting Technology: THT; Packaging: Tray; Row Number: Single; Orientation: Vertical; Supplier 1: Farnell; Manufacturer Part Number: 61300411821; Stock 1: 57; Pricing 1: 10 = 0,36400, 100 = 0,32400, 500 = 0,30300, 1000 = 0,29300, 2500 = 0,28300, 5000 = 0,27700 (EUR); RoHS: No; Contact Material: Copper Alloy; Category: Connectors, Interconnects Rectangular Connectors
LED1 LED2 LED5 LED6 = LTST-C171KRKT: LED RED CLEAR SMD; Manufacturer: Vishay Lite-On; Lens Color: Colorless; Viewing Angle: 130°; Lens Style: Diffused; Forward Current: 30mA; Forward Voltage: 2V; Power Rating: 75mW; Luminous Intensity: 54mcd; Test Current: 20mA; Dominant Wavelength: 631nm; Number of Elements: 1; Wavelength: 639nm; Reverse Voltage: 5V; Supplier 1: Digi-Key; Supplier Part Number 1: 160-1427-1-ND; Manufacturer Part Number: LTST-C171KRKT; RoHS: Yes; Stock 1: 137075; Pricing 1: 1 = 0,31000, 10 = 0,22500, 25 = 0,16560, 100 = 0,11830, 250 = 0,08040, 500 = 0,07096, 1000 = 0,05558 (USD); Mount: Surface Mount; Case/Package: 0805; Number of Pins: 2; Color: Red; Case Code (Metric): 2012; Case Code (Imperial): 0805; Min Operating Temperature: -55°C; Max Operating Temperature: 85°C; Package Quantity: 3000; Packaging: Tape and Reel; Illumination Color: Red; Lens Transparency: Clear; Power Dissipation: 75mW; Number of LEDs: 1; Length: 2mm; Height: 0.8mm; Width: 1.25mm; Depth: 1.25mm; Radiation Hardening: No; Lead Free: Lead Free; ComponentLink1URL: https://datasheet.ciiva.com/12403/lite-on-ltst-c171krkt-187201-12403781.pdf?src-supplier=Mouser; ComponentLink1Description: https://datasheet.ciiva.com/12403/lite-on-ltst-c171krkt-187201-12403781.pdf?src-supplier=Mouser; ComponentLink2URL: https://datasheet.ciiva.com/11775/0900766b80dc0299-11775643.pdf?src-supplier=RSComponents; ComponentLink2Description: https://datasheet.ciiva.com/11775/0900766b80dc0299-11775643.pdf?src-supplier=RSComponents; ComponentLink3URL: https://datasheet.ciiva.com/16444/lite-on20ltst-c171krkt-16444779.pdf?src-supplier=Future+Electronics; ComponentLink3Description: https://datasheet.ciiva.com/16444/lite-on20ltst-c171krkt-16444779.pdf?src-supplier=Future+Electronics; ComponentLink4URL: https://datasheet.ciiva.com/2110/s-110-ltst-c171krkt-2110066.pdf?src-supplier=Digi-Key; ComponentLink4Description: https://datasheet.ciiva.com/2110/s-110-ltst-c171krkt-2110066.pdf?src-supplier=Digi-Key; ComponentLink5URL: https://datasheet.ciiva.com/2110/s-110-ltst-c171krkt-2110067.pdf?src-supplier=Digi-Key; ComponentLink5Description: https://datasheet.ciiva.com/2110/s-110-ltst-c171krkt-2110067.pdf?src-supplier=Digi-Key; ComponentLink6URL: https://datasheet.ciiva.com/2110/s-110-ltst-c171krkt-2110068.pdf?src-supplier=Digi-Key; ComponentLink6Description: https://datasheet.ciiva.com/2110/s-110-ltst-c171krkt-2110068.pdf?src-supplier=Digi-Key; Category: LED Indication
R38 R39 R47 R48 = RC0603FR-071KL: 1K ,%1 ,1/10 W ,0603; Manufacturer: Yageo; Tolerance: 1%; Resistance: 1kR; Temperature Coefficient: 100ppm/°C; Power Rating: 100mW; Voltage Rating: 50V; Supplier 1: Digi-Key; Supplier Part Number 1: 311-1.00KHRCT-ND; Manufacturer Part Number: RC0603FR-071KL; Stock 1: 29851447; Pricing 1: 1 = 0,10000, 10 = 0,02100, 100 = 0,00840, 1000 = 0,00379, 2500 = 0,00329 (USD); RoHS: Yes; Case/Package: 0603; Contact Plating: Tin,Matte; Case Code (Imperial): 0603; Case Code (Metric): 1608; Min Operating Temperature: -55°C; Max Operating Temperature: 155°C; Packaging: Tape and Reel; Resistor Type: Thick Film; Termination: SMD/SMT; Length: 1.6mm; Height: 0.45mm; Depth: 0.8mm; Radiation Hardening: No; REACH SVHC: No SVHC; Lead Free: Lead Free; Military Standard: Not; ComponentLink1URL: https://datasheet.ciiva.com/11808/0900766b80f96399-11808081.pdf?src-supplier=RSComponents; ComponentLink1Description: https://datasheet.ciiva.com/11808/0900766b80f96399-11808081.pdf?src-supplier=RSComponents; ComponentLink2URL: https://datasheet.ciiva.com/25906/pyu-rc0603-51-rohs-l-4-25906933.pdf?src-supplier=Avnet+Europe; ComponentLink2Description: https://datasheet.ciiva.com/25906/pyu-rc0603-51-rohs-l-4-25906933.pdf?src-supplier=Avnet+Europe; ComponentLink3URL: https://datasheet.ciiva.com/7660/1868787-7660790.pdf?src-supplier=Element14; ComponentLink3Description: https://datasheet.ciiva.com/7660/1868787-7660790.pdf?src-supplier=Element14; ComponentLink4URL: https://datasheet.ciiva.com/7746/1738695-7746279.pdf?src-supplier=Element14; ComponentLink4Description: https://datasheet.ciiva.com/7746/1738695-7746279.pdf?src-supplier=Element14; ComponentLink5URL: https://datasheet.ciiva.com/7746/1686128-7746280.pdf?src-supplier=Element14; ComponentLink5Description: https://datasheet.ciiva.com/7746/1686128-7746280.pdf?src-supplier=Element14; ComponentLink6URL: https://datasheet.ciiva.com/28386/pyu-rc0603-51-rohs-l-4-28386648.pdf?src-supplier=Avnet+Europe; ComponentLink6Description: https://datasheet.ciiva.com/28386/pyu-rc0603-51-rohs-l-4-28386648.pdf?src-supplier=Avnet+Europe; ComponentLink7URL: https://datasheet.ciiva.com/7746/1738695-7746281.pdf?src-supplier=Element14; ComponentLink7Description: https://datasheet.ciiva.com/7746/1738695-7746281.pdf?src-supplier=Element14; ComponentLink8URL: https://datasheet.ciiva.com/8896/pyu-rc0603-51-rohs-l-4-8896106.pdf?src-supplier=Avnet; ComponentLink8Description: https://datasheet.ciiva.com/8896/pyu-rc0603-51-rohs-l-4-8896106.pdf?src-supplier=Avnet; ComponentLink9URL: https://datasheet.ciiva.com/15189/getdatasheetpartid-404327-15189644.pdf?src-supplier=Verical; ComponentLink9Description: https://datasheet.ciiva.com/15189/getdatasheetpartid-404327-15189644.pdf?src-supplier=Verical; ComponentLink10URL: https://datasheet.ciiva.com/7983/443971-7983613.pdf?src-supplier=Element14; ComponentLink10Description: https://datasheet.ciiva.com/7983/443971-7983613.pdf?src-supplier=Element14; Category: Resistor
R40-R42 = RC0603FR-070RL: 0R ,%1 ,1/10 W ,0603; Manufacturer: Yageo; Resistance: 0mR; Power Rating: 100mW; Tolerance: 1%; Voltage Rating: 50V; Temperature Coefficient: 200ppm/°C; Current Rating: 1A; Working Voltage: 75V; Supplier 1: Digi-Key; Supplier Part Number 1: 311-0.0HRCT-ND; Manufacturer Part Number: RC0603FR-070RL; Stock 1: 513794; Pricing 1: 1 = 0,10000, 10 = 0,01800, 25 = 0,01280, 50 = 0,00980, 100 = 0,00730, 250 = 0,00552, 500 = 0,00442, 1000 = 0,00326 (USD); RoHS: Yes; Case/Package: 0603; Number of Pins: 2; Case Code (Metric): 1608; Case Code (Imperial): 0603; Contact Plating: Tin,Matte; Min Operating Temperature: -55°C; Max Operating Temperature: 155°C; Packaging: Tape and Reel; Package Quantity: 5000; Resistor Type: Thick Film; Number of Terminations: 2; Termination: SMD/SMT; Max Power Dissipation: 100mW; Voltage Rating (DC): 50V; Features: Moisture Resistant; Length: 1.6mm; Width: 0.031inch; Height: 0.45mm; Depth: 0.8mm; Radiation Hardening: No; REACH SVHC: No SVHC; Military Standard: Not; Lead Free: Lead Free; ComponentLink1URL: https://datasheet.ciiva.com/11808/0900766b80f96399-11808172.pdf?src-supplier=RSComponents; ComponentLink1Description: https://datasheet.ciiva.com/11808/0900766b80f96399-11808172.pdf?src-supplier=RSComponents; ComponentLink2URL: https://datasheet.ciiva.com/5558/rc0603-272842-5558341.pdf?src-supplier=Mouser; ComponentLink2Description: https://datasheet.ciiva.com/5558/rc0603-272842-5558341.pdf?src-supplier=Mouser; ComponentLink3URL: https://datasheet.ciiva.com/46382/443971-46382072.pdf?src-supplier=Element14; ComponentLink3Description: https://datasheet.ciiva.com/46382/443971-46382072.pdf?src-supplier=Element14; ComponentLink4URL: https://datasheet.ciiva.com/29721/pyu-r-int-thick-7-29721178.pdf?src-supplier=Digi-Key; ComponentLink4Description: https://datasheet.ciiva.com/29721/pyu-r-int-thick-7-29721178.pdf?src-supplier=Digi-Key; ComponentLink5URL: https://datasheet.ciiva.com/5684/443971-5684699.pdf?src-supplier=Farnell; ComponentLink5Description: https://datasheet.ciiva.com/5684/443971-5684699.pdf?src-supplier=Farnell; ComponentLink6URL: https://datasheet.ciiva.com/7983/443971-7983627.pdf?src-supplier=Element14; ComponentLink6Description: https://datasheet.ciiva.com/7983/443971-7983627.pdf?src-supplier=Element14; ComponentLink7URL: https://datasheet.ciiva.com/29721/pyu-rc0603-51-rohs-l-4-29721179.pdf?src-supplier=Digi-Key; ComponentLink7Description: https://datasheet.ciiva.com/29721/pyu-rc0603-51-rohs-l-4-29721179.pdf?src-supplier=Digi-Key; ComponentLink8URL: https://datasheet.ciiva.com/22643/1868787-22643388.pdf?src-supplier=Element14; ComponentLink8Description: https://datasheet.ciiva.com/22643/1868787-22643388.pdf?src-supplier=Element14; Category: Resistor
R43 R63 = RC0603FR-074K7L: 4.7K OHM 1% 1/10W 0603; Manufacturer: Yageo; Resistance: 4.7kR; Voltage Rating (DC): 50V; Temperature Coefficient: 100ppm/°C; Power Rating: 100mW; Supplier 1: Digi-Key; Supplier Part Number 1: 311-4.70KHRCT-ND; Manufacturer Part Number: RC0603FR-074K7L; Stock 1: 5021901; Pricing 1: 1 = 0,10000, 10 = 0,02100, 100 = 0,00840, 1000 = 0,00379, 2500 = 0,00329 (USD); RoHS: Yes; Case/Package: 0603; Number of Pins: 2; Case Code (Imperial): 0603; Case Code (Metric): 1608; Min Operating Temperature: -55°C; Max Operating Temperature: 155°C; Packaging: Tape and Reel; Tolerance: 1%; Resistor Type: Thick Film; Voltage Rating: 50V; Termination: SMD/SMT; Length: 1.6mm; Width: 0.8mm; Height: 0.45mm; Depth: 0.8mm; Lead Pitch: 0.3mm; REACH SVHC: No SVHC; Lead Free: Lead Free; Military Standard: Not; ComponentLink1URL: https://datasheet.ciiva.com/15189/getdatasheetpartid-422754-15189760.pdf?src-supplier=Verical; ComponentLink1Description: https://datasheet.ciiva.com/15189/getdatasheetpartid-422754-15189760.pdf?src-supplier=Verical; ComponentLink2URL: https://datasheet.ciiva.com/22747/443971-22747528.pdf?src-supplier=Element14; ComponentLink2Description: https://datasheet.ciiva.com/22747/443971-22747528.pdf?src-supplier=Element14; ComponentLink3URL: https://datasheet.ciiva.com/7660/38590-7660794.pdf?src-supplier=Element14; ComponentLink3Description: https://datasheet.ciiva.com/7660/38590-7660794.pdf?src-supplier=Element14; ComponentLink4URL: https://datasheet.ciiva.com/7746/1868787-7746365.pdf?src-supplier=Element14; ComponentLink4Description: https://datasheet.ciiva.com/7746/1868787-7746365.pdf?src-supplier=Element14; ComponentLink5URL: https://datasheet.ciiva.com/46440/1868787-46440909.pdf?src-supplier=Element14; ComponentLink5Description: https://datasheet.ciiva.com/46440/1868787-46440909.pdf?src-supplier=Element14; ComponentLink6URL: https://datasheet.ciiva.com/7746/1738695-7746366.pdf?src-supplier=Element14; ComponentLink6Description: https://datasheet.ciiva.com/7746/1738695-7746366.pdf?src-supplier=Element14; Category: Resistor
R44 = RC0603FR-07220RL: 220 R, %1, 1/10W, 0603; Manufacturer: Yageo; Tolerance: 1%; Voltage Rating (DC): 50V; Temperature Coefficient: 100ppm/°C; Power Rating: 100mW; Supplier 1: Digi-Key; Supplier Part Number 1: 311-220HRCT-ND; Manufacturer Part Number: RC0603FR-07220RL; Stock 1: 3174401; Pricing 1: 1 = 0,10000, 10 = 0,02100, 100 = 0,00840, 1000 = 0,00379, 2500 = 0,00329 (USD); RoHS: Yes; Case/Package: 0603; Number of Pins: 2; Case Code (Imperial): 0603; Case Code (Metric): 1608; Min Operating Temperature: -55°C; Max Operating Temperature: 155°C; Resistance: 220R; Packaging: Tape and Reel; Resistor Type: Thick Film; Voltage Rating: 50V; Package Quantity: 1; Termination: SMD/SMT; Number of Terminations: 2; Max Power Dissipation: 100mW; Features: Moisture Resistant; Length: 1.6mm; Width: 0.031inch; Height: 0.022inch; Depth: 0.8mm; REACH SVHC: No SVHC; Lead Free: Lead Free; Military Standard: Not; ComponentLink1URL: https://datasheet.ciiva.com/2453/pyu-r-int-thick-7-2453973.pdf?src-supplier=Digi-Key; ComponentLink1Description: https://datasheet.ciiva.com/2453/pyu-r-int-thick-7-2453973.pdf?src-supplier=Digi-Key; ComponentLink2URL: https://datasheet.ciiva.com/2453/pyu-r-int-thick-7-2453974.pdf?src-supplier=Digi-Key; ComponentLink2Description: https://datasheet.ciiva.com/2453/pyu-r-int-thick-7-2453974.pdf?src-supplier=Digi-Key; ComponentLink3URL: https://datasheet.ciiva.com/2453/pyu-r-int-thick-7-2453975.pdf?src-supplier=Digi-Key; ComponentLink3Description: https://datasheet.ciiva.com/2453/pyu-r-int-thick-7-2453975.pdf?src-supplier=Digi-Key; ComponentLink4URL: https://datasheet.ciiva.com/7746/1738695-7746300.pdf?src-supplier=Element14; ComponentLink4Description: https://datasheet.ciiva.com/7746/1738695-7746300.pdf?src-supplier=Element14; ComponentLink5URL: https://datasheet.ciiva.com/7746/1738695-7746301.pdf?src-supplier=Element14; ComponentLink5Description: https://datasheet.ciiva.com/7746/1738695-7746301.pdf?src-supplier=Element14; Category: Resistor
R45 R64 R68 = RT0603FRE0710KL: 10K OHM 1% 1/10W 0603; Manufacturer: Yageo; Resistance: 10kR; Power Rating: 100mW; Voltage Rating: 75V; Temperature Coefficient: 50ppm/°C; Supplier 1: Digi-Key; Supplier Part Number 1: YAG2321CT-ND; Manufacturer Part Number: RT0603FRE0710KL; Stock 1: 326134; Pricing 1: 1 = 0,10000, 10 = 0,05600, 100 = 0,02270, 1000 = 0,01020, 2500 = 0,00886 (USD); RoHS: Yes; Case/Package: 0603; Number of Pins: 2; Case Code (Metric): 1608; Case Code (Imperial): 0603; Contact Plating: Tin,Lead; Min Operating Temperature: -55°C; Max Operating Temperature: 125°C; Package Quantity: 5000; Packaging: Tape and Reel; Tolerance: 1%; Resistor Type: Thin Film; Number of Terminations: 2; Termination: SMD/SMT; Max Power Dissipation: 100mW; Voltage Rating (DC): 75V; Features: Moisture Resistant; Length: 0.063inch; Width: 0.031inch; Height: 0.022inch; Depth: 0.8mm; REACH SVHC: Unknown; Military Standard: Not; Lead Free: Lead Free; ComponentLink1URL: https://datasheet.ciiva.com/2559/pyu-rt-1-to-0-05-rohs-l-5-2559482.pdf?src-supplier=Digi-Key; ComponentLink1Description: https://datasheet.ciiva.com/2559/pyu-rt-1-to-0-05-rohs-l-5-2559482.pdf?src-supplier=Digi-Key; ComponentLink2URL: https://datasheet.ciiva.com/16745/pyu-rt-1-to-0-05-rohs-l-4-16745739.pdf?src-supplier=Future+Electronics; ComponentLink2Description: https://datasheet.ciiva.com/16745/pyu-rt-1-to-0-05-rohs-l-4-16745739.pdf?src-supplier=Future+Electronics; ComponentLink3URL: https://datasheet.ciiva.com/12694/pyu-rt-1-to-0-05-rohs-l-4-12694910.pdf?src-supplier=Mouser; ComponentLink3Description: https://datasheet.ciiva.com/12694/pyu-rt-1-to-0-05-rohs-l-4-12694910.pdf?src-supplier=Mouser; Category: Resistor
R46 = RC0603FR-07100KL: 100K ,%1 ,1/10 W ,0603; Manufacturer: Yageo; Tolerance: 1%; Resistance: 100kR; Temperature Coefficient: 100ppm/°C; Voltage Rating (DC): 50V; Power Rating: 100mW; Working Voltage: 75V; Supplier 1: Digi-Key; Supplier Part Number 1: 311-100KHRCT-ND; Manufacturer Part Number: RC0603FR-07100KL; Stock 1: 10054915; Pricing 1: 1 = 0,10000, 10 = 0,02100, 100 = 0,00840, 1000 = 0,00379, 2500 = 0,00329 (USD); RoHS: Yes; Case/Package: 0603; Number of Pins: 2; Case Code (Imperial): 0603; Case Code (Metric): 1608; Min Operating Temperature: -55°C; Max Operating Temperature: 155°C; Packaging: Tape and Reel; Resistor Type: Thick Film; Voltage Rating: 50V; Termination: SMD/SMT; Number of Terminations: 2; Length: 1.6mm; Width: 0.8mm; Height: 0.45mm; Depth: 0.8mm; REACH SVHC: No SVHC; Lead Free: Lead Free; Military Standard: Not; ComponentLink1URL: https://datasheet.ciiva.com/11808/0900766b80f96399-11808107.pdf?src-supplier=RSComponents; ComponentLink1Description: https://datasheet.ciiva.com/11808/0900766b80f96399-11808107.pdf?src-supplier=RSComponents; ComponentLink2URL: https://datasheet.ciiva.com/7983/443971-7983593.pdf?src-supplier=Element14; ComponentLink2Description: https://datasheet.ciiva.com/7983/443971-7983593.pdf?src-supplier=Element14; ComponentLink3URL: https://datasheet.ciiva.com/46440/1868787-46440889.pdf?src-supplier=Element14; ComponentLink3Description: https://datasheet.ciiva.com/46440/1868787-46440889.pdf?src-supplier=Element14; ComponentLink4URL: https://datasheet.ciiva.com/7746/1738695-7746234.pdf?src-supplier=Element14; ComponentLink4Description: https://datasheet.ciiva.com/7746/1738695-7746234.pdf?src-supplier=Element14; ComponentLink5URL: https://datasheet.ciiva.com/7746/1738695-7746235.pdf?src-supplier=Element14; ComponentLink5Description: https://datasheet.ciiva.com/7746/1738695-7746235.pdf?src-supplier=Element14; ComponentLink6URL: https://datasheet.ciiva.com/22747/443971-22747516.pdf?src-supplier=Element14; ComponentLink6Description: https://datasheet.ciiva.com/22747/443971-22747516.pdf?src-supplier=Element14; Category: Resistor
R88 R89 = RC0603FR-07100KL: 100K Ohm 1% 1/10W 0603; Manufacturer: Yageo; Resistance: 100kR; Temperature Coefficient: 100ppm/°C; Voltage Rating (DC): 50V; Power Rating: 100mW; Working Voltage: 75V; Supplier 1: Digi-Key; Supplier Part Number 1: 311-100KHRCT-ND; Manufacturer Part Number: RC0603FR-07100KL; Stock 1: 10054915; Pricing 1: 1 = 0,10000, 10 = 0,02100, 100 = 0,00840, 1000 = 0,00379, 2500 = 0,00329 (USD); RoHS: Yes; Case/Package: 0603; Number of Pins: 2; Case Code (Imperial): 0603; Case Code (Metric): 1608; Min Operating Temperature: -55°C; Max Operating Temperature: 155°C; Tolerance: 1%; Packaging: Tape and Reel; Resistor Type: Thick Film; Voltage Rating: 50V; Termination: SMD/SMT; Number of Terminations: 2; Length: 1.6mm; Width: 0.8mm; Height: 0.45mm; Depth: 0.8mm; REACH SVHC: No SVHC; Lead Free: Lead Free; Military Standard: Not; ComponentLink1URL: https://datasheet.ciiva.com/11808/0900766b80f96399-11808107.pdf?src-supplier=RSComponents; ComponentLink1Description: https://datasheet.ciiva.com/11808/0900766b80f96399-11808107.pdf?src-supplier=RSComponents; ComponentLink2URL: https://datasheet.ciiva.com/7983/443971-7983593.pdf?src-supplier=Element14; ComponentLink2Description: https://datasheet.ciiva.com/7983/443971-7983593.pdf?src-supplier=Element14; ComponentLink3URL: https://datasheet.ciiva.com/46440/1868787-46440889.pdf?src-supplier=Element14; ComponentLink3Description: https://datasheet.ciiva.com/46440/1868787-46440889.pdf?src-supplier=Element14; ComponentLink4URL: https://datasheet.ciiva.com/7746/1738695-7746234.pdf?src-supplier=Element14; ComponentLink4Description: https://datasheet.ciiva.com/7746/1738695-7746234.pdf?src-supplier=Element14; ComponentLink5URL: https://datasheet.ciiva.com/7746/1738695-7746235.pdf?src-supplier=Element14; ComponentLink5Description: https://datasheet.ciiva.com/7746/1738695-7746235.pdf?src-supplier=Element14; ComponentLink6URL: https://datasheet.ciiva.com/22747/443971-22747516.pdf?src-supplier=Element14; ComponentLink6Description: https://datasheet.ciiva.com/22747/443971-22747516.pdf?src-supplier=Element14; Category: Resistor
SW1 SW2 = L-KLS7-TS6606-9.0-250: Right angle 6X6X9mm; Manufucturer: KLS ELECTRONIC; Category: Switches - Tactile Switches
TP3-TP5 = TestPoint1: test ölçüm noktası; Category: TestPoint
TR3 TR7 TR8 = BC847,215: TRANS NPN 45V 0.1A SOT23; Manufacturer: Nexperia; Supplier 1: Digi-Key; Supplier Part Number 1: 1727-4855-1-ND; Manufacturer Part Number: BC847,215; Stock 1: 236151; Pricing 1: 1=0,14000, 10=0,12500, 100=0,06800, 500=0,04186, 1000=0,02854 (USD); RoHS: No; ComponentLink1URL: http://www.farnell.com/datasheets/1856333.pdf?src-supplier=Farnell; ComponentLink1Description: http://www.farnell.com/datasheets/1856333.pdf?src-supplier=Farnell; ComponentLink2URL: https://assets.nexperia.com/documents/data-sheet/BC847_SER.pdf?src-supplier=Digi-Key; ComponentLink2Description: https://assets.nexperia.com/documents/data-sheet/BC847_SER.pdf?src-supplier=Digi-Key; ComponentLink3URL: http://www.farnell.com/datasheets/1856333.pdf?src-supplier=Newark; ComponentLink3Description: http://www.farnell.com/datasheets/1856333.pdf?src-supplier=Newark; ComponentLink4URL: http://www.farnell.com/datasheets/1856333.pdf?src-supplier=Element14; ComponentLink4Description: http://www.farnell.com/datasheets/1856333.pdf?src-supplier=Element14; Category: Transistor-BJT
TVS12 = 824014885: TVS DIODE 5V 10.5V DFN3810-9; Manufacturer: Wurth Electronics; Supplier 1: Digi-Key; Supplier Part Number 1: 732-11797-1-ND; Manufacturer Part Number: 824014885; Stock 1: 5123; Pricing 1: 1 = 1,19000, 10 = 1,08000, 100 = 0,97000, 500 = 0,85000, 1000 = 0,76000 (USD); RoHS: No; ComponentLink1URL: https://katalog.we-online.de/pbs/datasheet/824014885.pdf?src-supplier=Digi-Key; ComponentLink1Description: https://katalog.we-online.de/pbs/datasheet/824014885.pdf?src-supplier=Digi-Key; Category: Circuit Protection - TVS - Diodes